# Altium schematic sheet BMS_LOST_V1.SchDoc
size A4
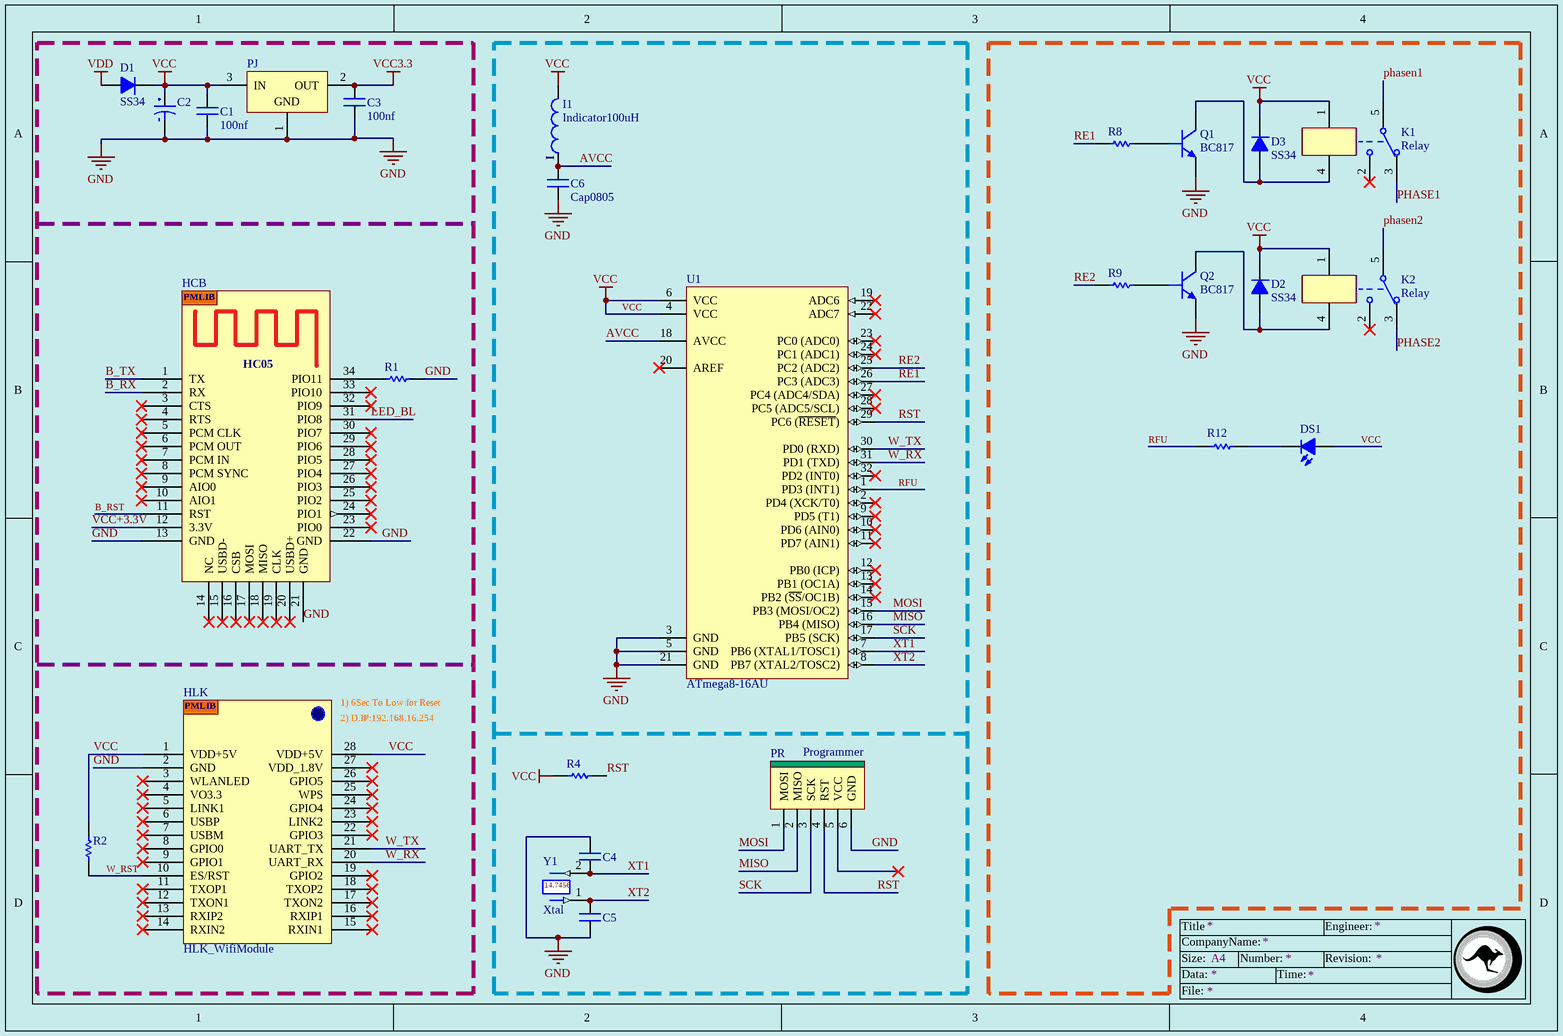
[diagram p0: BMS_LOST_V1.SchDoc]

## Parts
C1  100nf  [Cap0805]
C2  Cap_4mm  [2220]  (value not drawn)
C3  100nf  [Cap0805]
C4  CAP 805  [Cap0805]  (value not drawn)
C5  CAP 805  [Cap0805]  (value not drawn)
C6  Cap0805  [Cap0805]
D1  SS34  [Diod-1A-SMD]
D2  SS34  [Diod-1A-SMD]
D3  SS34  [Diod-1A-SMD]
DS1  LED1  [LED3MM]  (value not drawn)
HC  HC05_Bluetooth  [HC05_Bluetooth]  (value not drawn)  (part B of 2)
HLK  HLK_WifiModule  [HLK]
I1  Indicator100uH  [Indicator0805]
K1  Relay  [RelayMilionMiniS-Z]
K2  Relay  [RelayMilionMiniS-Z]
PJ  PJ1117_3.3V  [PJ1117s]  (value not drawn)
PR  Programmer  [Programmer]
Q1  BC817  [SOT23]
Q2  BC817  [SOT23]
R1  Res 0805  [R0805]  (value not drawn)
R2  Res 0805  [R0805]  (value not drawn)
R4  Res 0805  [R0805]  (value not drawn)
R8  Res 0805  [R0805]  (value not drawn)
R9  Res 0805  [R0805]  (value not drawn)
R12  330  [R0805]  (value not drawn)
U1  ATmega8-16AU  [32A_N]
Y1  Xtal  [CrystallB]

## Nets
GND: C1.2 C2.1 C3.2 C4.2 C5.1 C6.1 HC.13(GND) HC.21(GND) HC.22(GND) HLK.2(GND) PJ.1(GND) PR.6(GND) Q1.2(E) Q2.2(E) R1.1 U1.3(GND) U1.5(GND) U1.21(GND)
VCC: C1.1 C2.2 D1.K D2.K D3.K DS1.A HLK.1(VDD+5V) HLK.28(VDD+5V) I1.2 K1.1 K2.1 PJ.3(IN) R2.1 R4.2 U1.4(VCC) U1.6(VCC)
VCC3.3: C3.1 PJ.2(OUT)
VDD: D1.A
AVCC: C6.2 I1.1 U1.18(AVCC)
B_RST: HC.11(RST)
B_RX: HC.2(RX)
B_TX: HC.1(TX)
LED_BL: HC.31(PIO8)
MISO: PR.2(MISO) U1.16(PB4_(MISO))
MOSI: PR.1(MOSI) U1.15(PB3_(MOSI/OC2))
PHASE1: K1.3
PHASE2: K2.3
phasen1: K1.5
phasen2: K2.5
RE1: R8.2 U1.26(PC3_(ADC3))
RE2: R9.2 U1.25(PC2_(ADC2))
RFU: R12.2 U1.1(PD3_(INT1))
RST: PR.4(RST) R4.1 U1.29(PC6_(~{RESET}))
SCK: PR.3(SCK) U1.17(PB5_(SCK))
VCC+3.3V: HC.12(3.3V)
W_RST: HLK.10(ES/RST) R2.2
W_RX: HLK.20(UART_RX) U1.31(PD1_(TXD))
W_TX: HLK.21(UART_TX) U1.30(PD0_(RXD))
XT1: C4.1 U1.7(PB6_(XTAL1/TOSC1)) Y1.2
XT2: C5.2 U1.8(PB7_(XTAL2/TOSC2)) Y1.1
NetD2_A: D2.A K2.4 Q2.3(C)
NetD3_A: D3.A K1.4 Q1.3(C)
NetDS1_K: DS1.K R12.1
NetHC_34: HC.34(PIO11) R1.2
NetQ1_1: Q1.1(B) R8.1
NetQ2_1: Q2.1(B) R9.1

Not connected (* = marked no-connect by the designer): HC 3(CTS)* 4(RTS)* 5(PCM_CLK)* 6(PCM_OUT)* 7(PCM_IN)* 8(PCM_SYNC)* 9(AIO0)* 10(AIO1)* 14(NC)* 15(USBD-)* 16(CSB)* 17(MOSI)* 18(MISO)* 19(CLK)* 20(USBD+)* 23(PIO0)* 24(PIO1)* 25(PIO2)* 26(PIO3)* 27(PIO4)* 28(PIO5)* 29(PIO6)* 30(PIO7)* 32(PIO9)* 33(PIO10)*; HLK 3(WLANLED)* 4(VO3.3)* 5(LINK1)* 6(USBP)* 7(USBM)* 8(GPIO0)* 9(GPIO1)* 11(TXOP1)* 12(TXON1)* 13(RXIP2)* 14(RXIN2)* 15(RXIN1)* 16(RXIP1)* 17(TXON2)* 18(TXOP2)* 19(GPIO2)* 22(GPIO3)* 23(LINK2)* 24(GPIO4)* 25(WPS)* 26(GPIO5)* 27(VDD_1.8V)*; K1 2*; K2 2*; PR 5(VCC)*; U1 2(PD4_(XCK/T0))* 9(PD5_(T1))* 10(PD6_(AIN0))* 11(PD7_(AIN1))* 12(PB0_(ICP))* 13(PB1_(OC1A))* 14(PB2_(~{SS}/OC1B))* 19(ADC6)* 20(AREF)* 22(ADC7)* 23(PC0_(ADC0))* 24(PC1_(ADC1))* 27(PC4_(ADC4/SDA))* 28(PC5_(ADC5/SCL))* 32(PD2_(INT0))*

## Notes on the sheet
- (near HLK) 1) 6Sec To Low for Reset
- (near HLK) 2) D.IP:192.168.16.254
- Title
- Size:
- Data:
- CompanyName:
- A4
- Number:
- Time:
- Revision:
- Engineer:
- File:
- (in symbol Crystal) 14.7456
- (in symbol HC05_Bluetooth, part B) PMLIB; HC05
- (in symbol HLK_WifiModule) PMLIB
- (in symbol Indicator100uH) I

## Library data of the parts
C1 C3-C6 = Cap0805: surface mount capacitor (size 805)
C2 = Cap_Pola
D1-D3 = Diode
K1 K2 = RelayMilon
Q1 Q2 = Transistor NPN
R12 = Res 0805
U1 = ATmega8-16AU: 8-bit AVR Microcontroller, 4.5-5.5V, 16MHz, 8KB Flash, 512 Bytes EEPROM, 1KB SRAM, 32-pin TQFP, Industrial Grade (-40°C to 85°C); DatasheetVersion: revZ, Feb-2011; PackageVersion: revC, Oct-2010; PackageReference: 32A; PackageDescription: 32-Lead, 7x7x1.0 mm Body, 0.8mm Lead Pitch, Thin Profile Plastic Quad Flat Package (TQFP); Code_JEDEC: MS-026-ABA; ComponentLink1Description: Manufacturer URL; ComponentLink1URL: http://www.atmel.com/; ComponentLink2Description: ATmega8(L); ComponentLink2URL: http://www.atmel.com/dyn/resources/prod_documents/doc2486.pdf; ComponentLink3Description: ATmega8(L) Summary; ComponentLink3URL: http://www.atmel.com/dyn/resources/prod_documents/2486S.pdf
Y1 = Crystal